# Altium schematic sheet Microcontroller.SchDoc: Title
size 297 x 210 mm; Date: *******; ApprovedBy: *******; CheckedBy: None; Author: *******; CompanyName: *******; DrawnBy: Jacob Chisholm; Engineer: *******; Organization: *******; Address1: *******; Address2: *******; Address3: *******; Address4: *******; DocumentNumber: 1; Revision: *******; SheetNumber: 1; SheetTotal: *******; Address_Website: https://jchisholm204.github.io; E-Mail: JacobChisholm1010@gmail.com; CurrentTime: *******; CurrentDate: *******; Time: *******; DocumentFullPathAndName: *******; DocumentName: *******; ModifiedDate: *******; ImagePath: *******; ProjectName: *******; Application_BuildNumber: *******
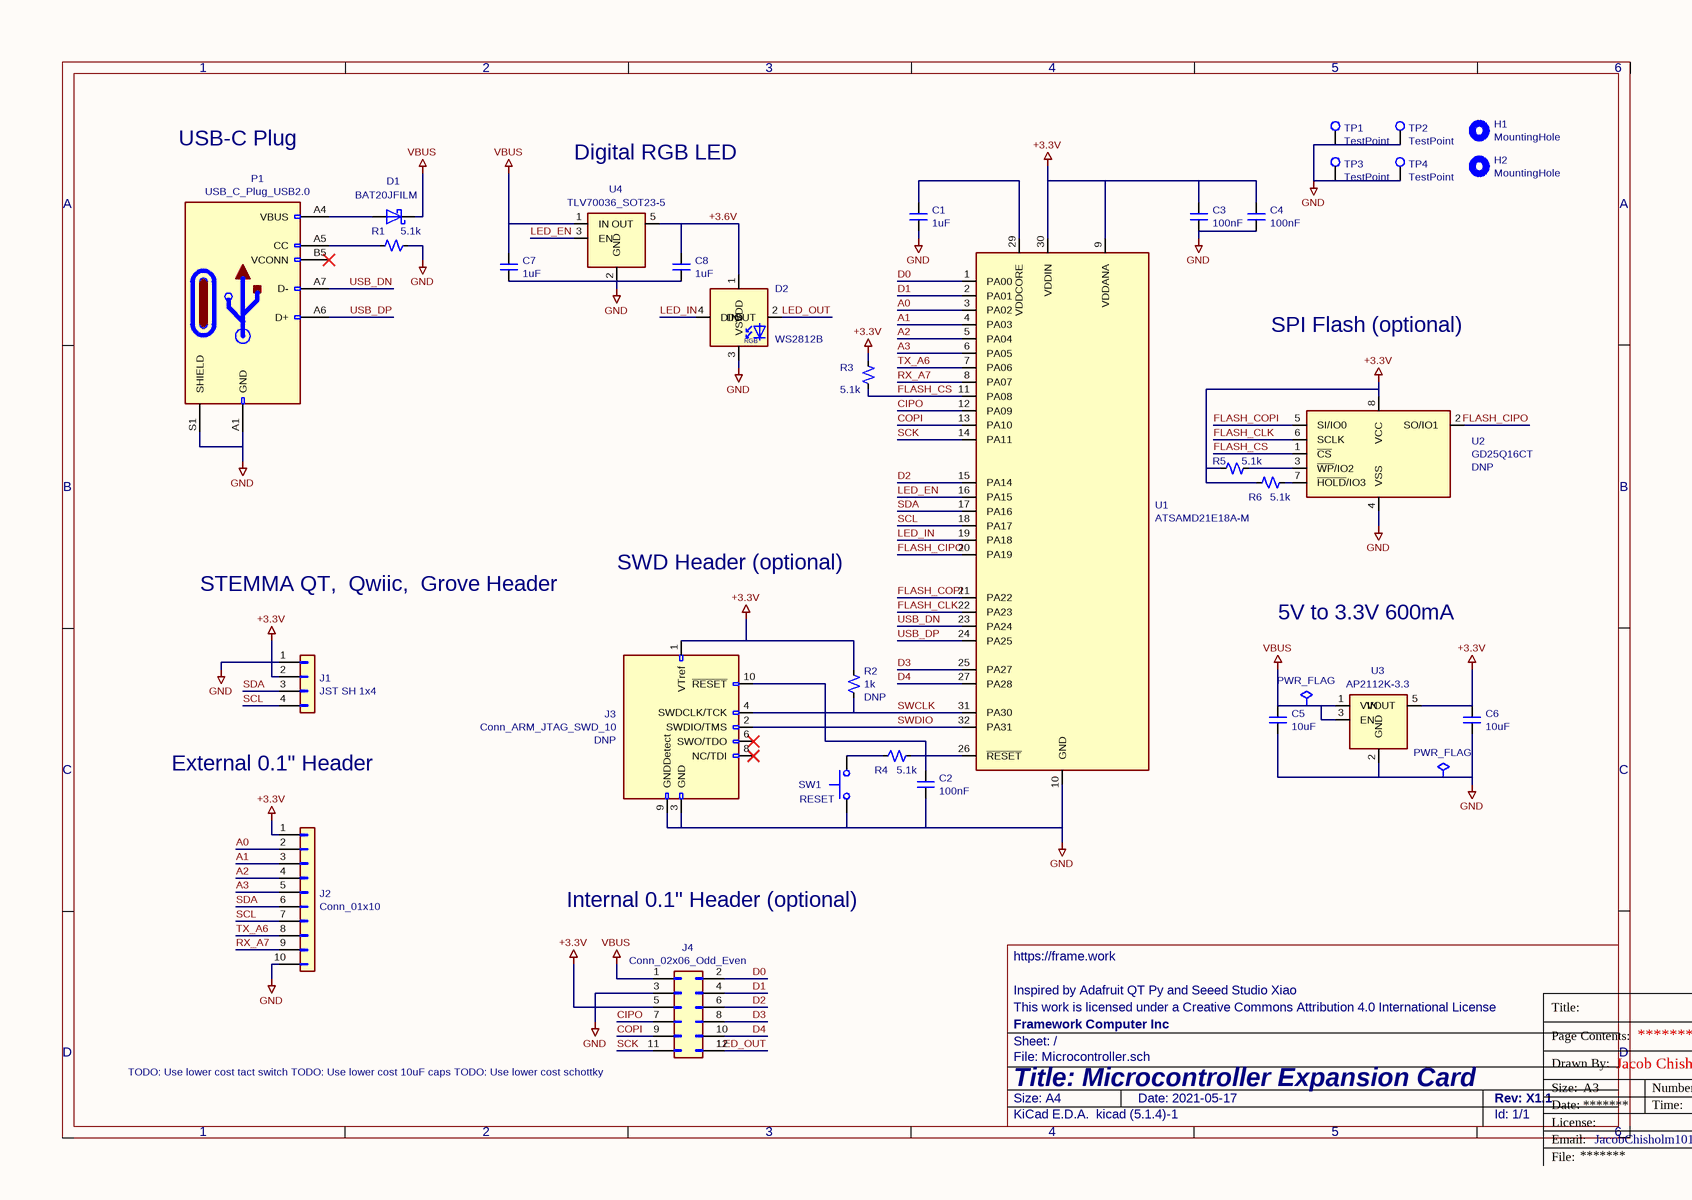
[diagram p0: Microcontroller.SchDoc]

## Parts
#FLG02  PWR_FLAG  (graphical)
#FLG03  PWR_FLAG  (graphical)
C1  1uF  [C_0603_1608Metric]
C2  100nF  [C_0603_1608Metric]
C3  100nF  [C_0603_1608Metric]
C4  100nF  [C_0603_1608Metric]
C5  10uF  [C_0805_2012Metric]
C6  10uF  [C_0805_2012Metric]
C7  1uF  [C_0603_1608Metric]
C8  1uF  [C_0603_1608Metric]
D1  BAT20JFILM  [D_SOD-323]
D2  WS2812B  [LED_WS2812B_PLCC4_5.0x5.0mm_P3.2mm]
H1  MountingHole  [MountingHole_2.2mm_M2]
H2  MountingHole  [MountingHole_2.2mm_M2]
J1  JST SH 1x4  [JST_SH_SM04B-SRSS-TB_1x04-1MP_P1.00mm_Horizontal]
J2  Conn_01x10  [PinSocket_8FM-78-0010-02-146_1x10_P2.54mm_Horizontal_SMD]
J3  Population: DNP  [PinHeader_2x05_P1.27mm_Vertical_SMD]  (hidden comment: Conn_ARM_JTAG_SWD_10)
J4  Conn_02x06_Odd_Even  [PinHeader_2x06_P2.54mm_Vertical]
P1  USB_C_Plug_USB2.0  [USB_C_Plug_Molex_105444]
R1  5.1k  [R_0603_1608Metric]
R2  Population: DNP  [R_0603_1608Metric]  (hidden comment: 1k)
R3  5.1k  [R_0603_1608Metric]
R4  5.1k  [R_0603_1608Metric]
R5  5.1k  [R_0603_1608Metric]
R6  5.1k  [R_0603_1608Metric]
SW1  RESET  [SW_SPST_B3U-3100P]
TP1  TestPoint  [TestPoint_Pad_1.5x1.5mm]
TP2  TestPoint  [TestPoint_Pad_1.5x1.5mm]
TP3  TestPoint  [TestPoint_Pad_1.5x1.5mm]
TP4  TestPoint  [TestPoint_Pad_1.5x1.5mm]
U1  ATSAMD21E18A-M  [QFN-32-1EP_5x5mm_P0.5mm_EP3.6x3.6mm]
U2  Population: DNP  [SOP-8_3.9x4.9mm_P1.27mm]  (hidden comment: GD25Q16CT)
U3  AP2112K-3.3  [SOT-23-5]
U4  TLV70036_SOT23-5  [SOT-23-5]

## Nets
+3.3V: C3.1 C4.1 C6.1 J1.2(Pin_2) J2.1(Pin_1) J3.1(VTref) J4.5(Pin_5) R2.1 R3.1 R5.1 R6.1 U1.9(VDDANA) U1.30(VDDIN) U2.8(VCC) U3.5(VOUT)
GND: #FLG03.1(pwr) C1.2 C2.2 C3.2 C4.2 C5.2 C6.2 C7.2 C8.2 D2.3(VSS) J1.1(Pin_1) J2.10(Pin_10) J3.3(GND) J3.9(GNDDetect) J4.3(Pin_3) P1.A1(GND) P1.S1(SHIELD) R1.2 SW1.1 TP1.1 TP2.1 TP3.1 TP4.1 U1.10(GND) U2.4(VSS) U3.2(GND) U4.2(GND)
VBUS: #FLG02.1(pwr) C5.1 C7.1 D1.1(K) J4.1(Pin_1) U3.1(VIN) U3.3(EN) U4.1(IN)
+3.6V: C8.1 D2.1(VDD) U4.5(OUT)
A0: J2.2(Pin_2) U1.3(PA02)
A1: J2.3(Pin_3) U1.4(PA03)
A2: J2.4(Pin_4) U1.5(PA04)
A3: J2.5(Pin_5) U1.6(PA05)
CIPO: J4.7(Pin_7) U1.12(PA09)
COPI: J4.9(Pin_9) U1.13(PA10)
D0: J4.2(Pin_2) U1.1(PA00)
D1: J4.4(Pin_4) U1.2(PA01)
D2: J4.6(Pin_6) U1.15(PA14)
D3: J4.8(Pin_8) U1.25(PA27)
D4: J4.10(Pin_10) U1.27(PA28)
FLASH_CIPO: U1.20(PA19) U2.2(SO/IO1)
FLASH_CLK: U1.22(PA23) U2.6(SCLK)
FLASH_COPI: U1.21(PA22) U2.5(SI/IO0)
FLASH_CS: R3.2 U1.11(PA08) U2.1(~{CS})
LED_EN: U1.16(PA15) U4.3(EN)
LED_IN: D2.4(DIN) U1.19(PA18)
LED_OUT: D2.2(DOUT) J4.12(Pin_12)
RX_A7: J2.9(Pin_9) U1.8(PA07)
SCK: J4.11(Pin_11) U1.14(PA11)
SCL: J1.4(Pin_4) J2.7(Pin_7) U1.18(PA17)
SDA: J1.3(Pin_3) J2.6(Pin_6) U1.17(PA16)
SWCLK: J3.4(SWDCLK/TCK) R2.2 U1.31(PA30)
SWDIO: J3.2(SWDIO/TMS) U1.32(PA31)
TX_A6: J2.8(Pin_8) U1.7(PA06)
USB_DN: P1.A7(D-) U1.23(PA24)
USB_DP: P1.A6(D+) U1.24(PA25)
NetC1_1: C1.1 U1.29(VDDCORE)
NetC2_1: C2.1 J3.10(~{RESET}) R4.2 U1.26(~{RESET})
NetD1_2: D1.2(A) P1.A4(VBUS)
NetP1_A5: P1.A5(CC) R1.1
NetR4_1: R4.1 SW1.2
NetR5_2: R5.2 U2.3(~{WP}/IO2)
NetR6_2: R6.2 U2.7(~{HOLD}/IO3)

Not connected (* = marked no-connect by the designer): J3 5(GND) 6(SWO/TDO)* 7(KEY) 8(NC/TDI)*; P1 A9(VBUS) A12(GND) B1(GND) B4(VBUS) B5(VCONN)* B9(VBUS) B12(GND); U1 28(GND) 33(EP); U3 4(NC); U4 4(NC)

## Notes on the sheet
- USB-C Plug
- Digital RGB LED
- SPI Flash (optional)
- SWD Header
  (optional)
- STEMMA QT,
  Qwiic,
  Grove Header
- 5V to 3.3V 600mA
- External 0.1" Header
- Internal 0.1" Header
  (optional)
- (near J4) TODO: Use lower cost tact switch
  TODO: Use lower cost 10uF caps
  TODO: Use lower cost schottky
- 1
- 2
- 3
- 4
- 5
- 6
- A
- B
- C
- This work is licensed under a Creative Commons Attribution 4.0 International License
- Inspired by Adafruit QT Py and Seeed Studio Xiao
- https://frame.work
- Title:
- D
- Title: Microcontroller Expansion Card
- File: Microcontroller.sch
- Sheet: /
- Framework Computer Inc
- Drawn By:
- Page Contents:
- Checked By:
- KiCad E.D.A.  kicad (5.1.4)-1
- Size: A4
- Date: 2021-05-17
- Rev: X1.1
- Id: 1/1
- Size:
- Date:
- File:
- License:
- Email:
- A3
- Number:
- Time:
- Revision:
- Sheet
- Website:
- of
- (in symbol WS2812B) RGB

## Library data of the parts
C1-C8 = C_Small
  C1 C7 C8: Value: 1uF; Footprint: Capacitor_SMD:C_0603_1608Metric
  C2-C4: Value: 100nF; Footprint: Capacitor_SMD:C_0603_1608Metric
  C5 C6: Value: 10uF; Footprint: Capacitor_SMD:C_0805_2012Metric
D1 = D_Schottky: Value: BAT20JFILM; Footprint: Diode_SMD:D_SOD-323
J1 = Conn_01x04: Value: JST SH 1x4; Footprint: Connector_JST:JST_SH_SM04B-SRSS-TB_1x04-1MP_P1.00mm_Horizontal
R1-R6 = R_Small_US: Footprint: Resistor_SMD:R_0603_1608Metric
  R1 R3-R6: Value: 5.1k
  R2: Value: 1k
SW1 = SW_Push: Value: RESET; Footprint: Button_Switch_SMD:SW_SPST_B3U-3100P
#FLG02 #FLG03 = PWR_FLAG: Value: PWR_FLAG
D2 = WS2812B: Value: WS2812B; Footprint: LED_SMD:LED_WS2812B_PLCC4_5.0x5.0mm_P3.2mm
H1 H2 = MountingHole: Value: MountingHole; Footprint: MountingHole:MountingHole_2.2mm_M2
J2 = Conn_01x10: Value: Conn_01x10; Footprint: Microcontroller:PinSocket_8FM-78-0010-02-146_1x10_P2.54mm_Horizontal_SMD
J3 = Conn_ARM_JTAG_SWD_10: Value: Conn_ARM_JTAG_SWD_10; Footprint: Connector_PinHeader_1.27mm:PinHeader_2x05_P1.27mm_Vertical_SMD
J4 = Conn_02x06_Odd_Even: Value: Conn_02x06_Odd_Even; Footprint: Connector_PinHeader_2.54mm:PinHeader_2x06_P2.54mm_Vertical
P1 = USB_C_Plug_USB2.0: Value: USB_C_Plug_USB2.0; Footprint: Microcontroller:USB_C_Plug_Molex_105444
TP1-TP4 = TestPoint: Value: TestPoint; Footprint: TestPoint:TestPoint_Pad_1.5x1.5mm
U1 = ATSAMD21E18A-M: Value: ATSAMD21E18A-M; Footprint: Package_DFN_QFN:QFN-32-1EP_5x5mm_P0.5mm_EP3.6x3.6mm
U2 = GD25Q16CT: Value: GD25Q16CT; Footprint: Package_SO:SOP-8_3.9x4.9mm_P1.27mm
U3 = AP2112K-3.3: Value: AP2112K-3.3; Footprint: Package_TO_SOT_SMD:SOT-23-5
U4 = TLV70036_SOT23-5: Value: TLV70036_SOT23-5; Footprint: Package_TO_SOT_SMD:SOT-23-5